# EAGLE design basic_Arduino (EAGLE 9.6.2)
CNAME: MICRO CONTROLLER+POWER+HEADERS; CREVISON: V1.0.0; DESIGNER: V KALYAN REDDY; REV: v1.0.0
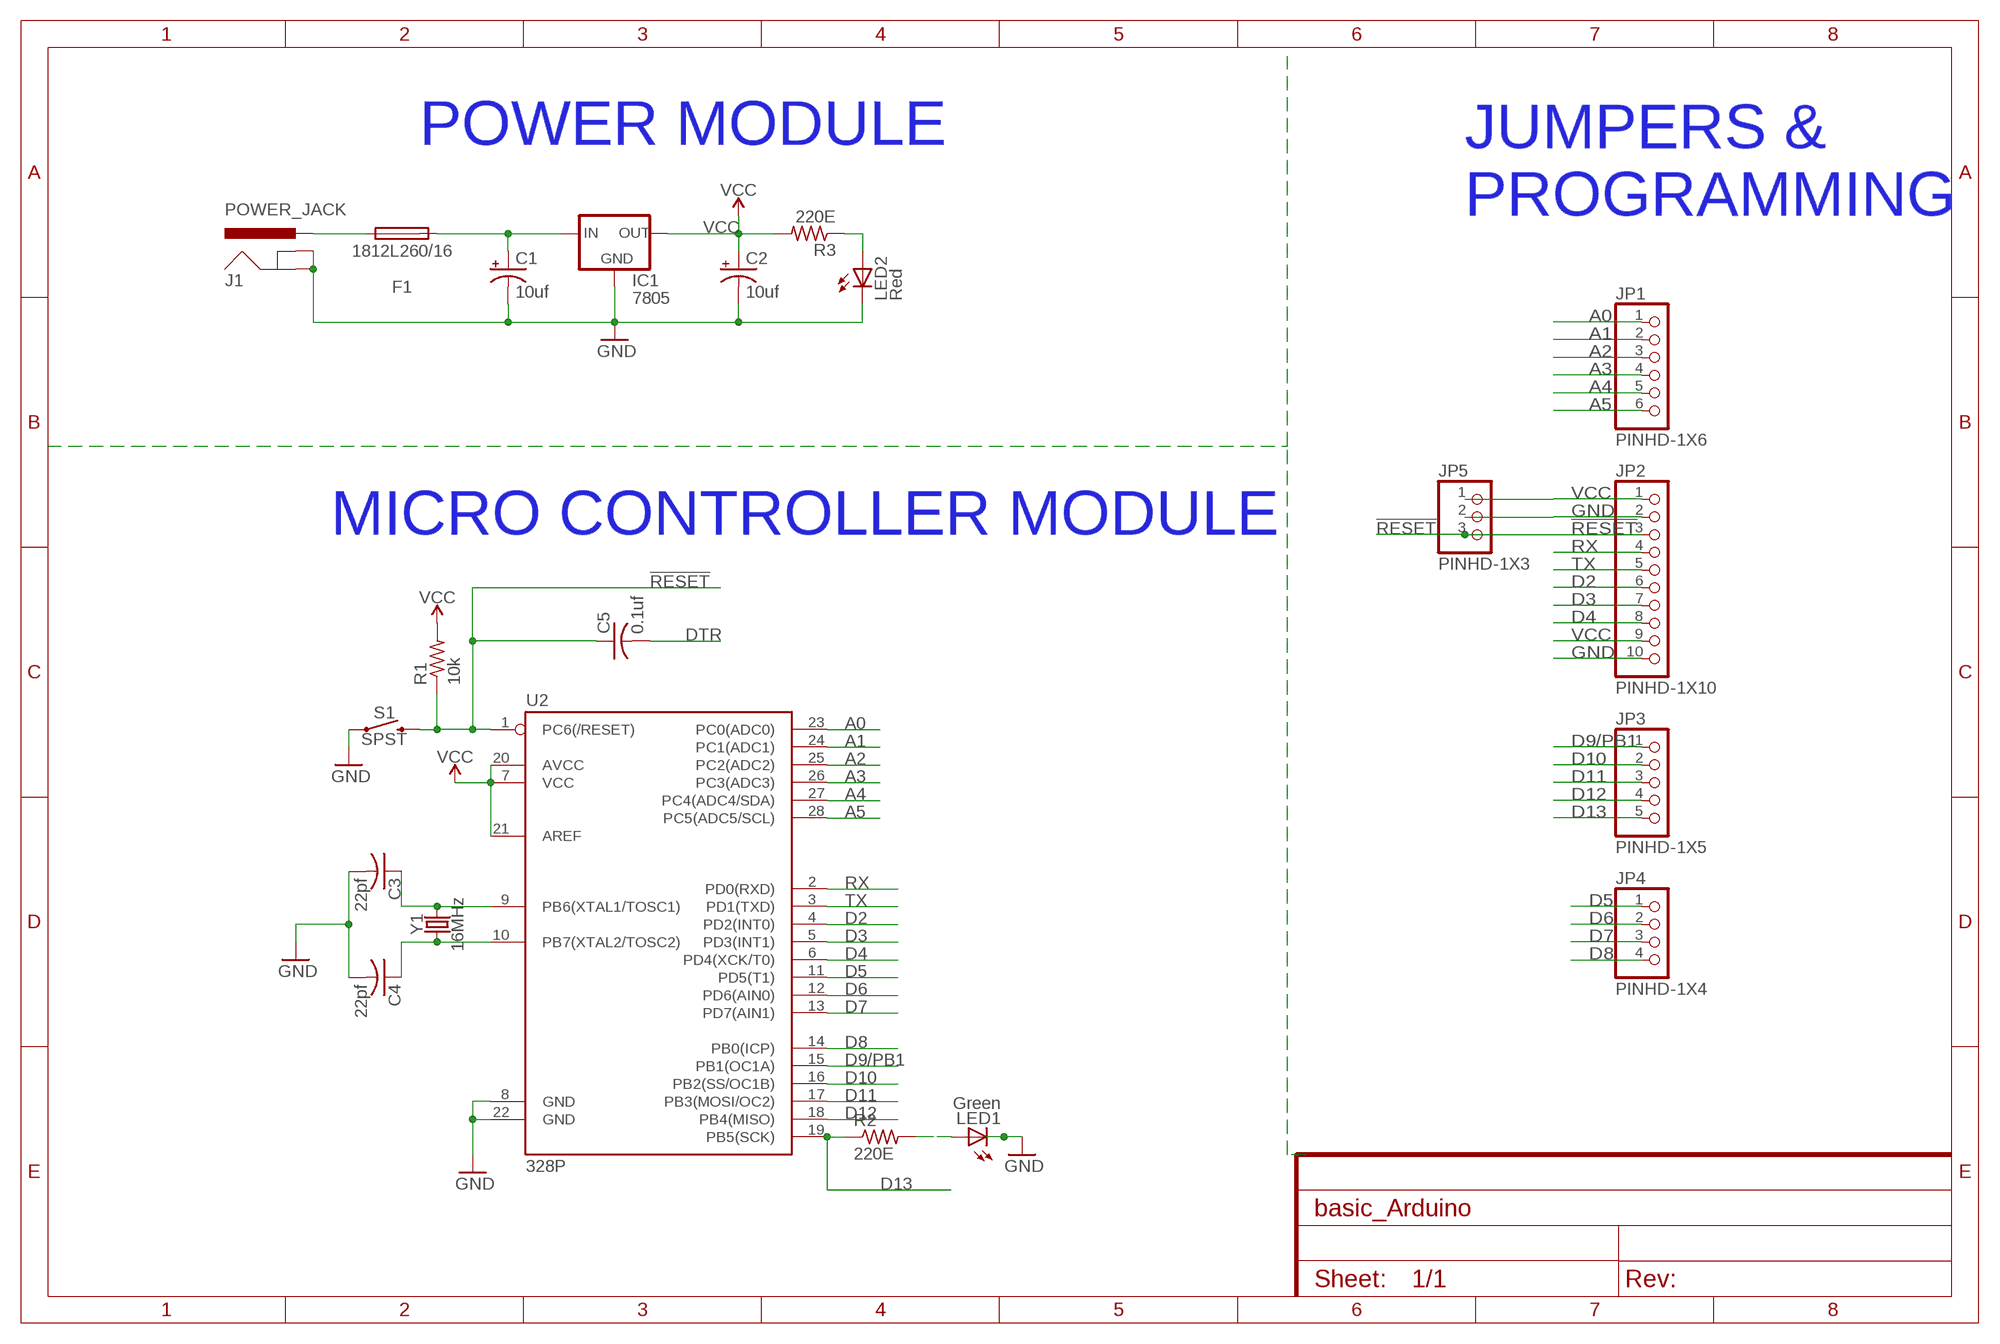
[diagram p0: schematic, sheet 1]

## Parts
C1  10uf  CPOL-USE2,5-6E  [E2,5-6E]
C2  10uf  CPOL-USE2,5-6E  [E2,5-6E]
C3  22pf  C-US025-024X044  [C025-024X044]
C4  22pf  C-US025-024X044  [C025-024X044]
C5  0.1uf  C-US025-024X044  [C025-024X044]
F1  1812L260/16  [FUSC4532X125]
IC1  7805  78XXS  [78XXS]
J1  POWER_JACK  [POWER_JACK_PTH]
JP1  PINHD-1X6  [1X06]
JP2  PINHD-1X10  [1X10]
JP3  PINHD-1X5  [1X05]
JP4  PINHD-1X4  [1X04]
JP5  PINHD-1X3  [1X03]
LED1  Green  LED3MM  [LED3MM]
LED2  Red  LED3MM  [LED3MM]
R1  10k  R-US_0204/7  [0204/7]
R2  220E  R-US_0204/7  [0204/7]
R3  220E  R-US_0204/7  [0204/7]
S1  SPST  MOMENTARY-SWITCH-SPST-PTH-6.0MM  [TACTILE_SWITCH_PTH_6.0MM]
U2  328P  ATMEGA328P_PDIP  [DIP28]
Y1  16MHz  CRYSTAL-16MHZPTH-HC49US  [HC49US]

## Nets
!RESET: C5.1 JP2.3 JP5.3 R1.1 S1.3 U2.1(PC6(/RESET))
A0: JP1.1 U2.23(PC0(ADC0))
A1: JP1.2 U2.24(PC1(ADC1))
A2: JP1.3 U2.25(PC2(ADC2))
A3: JP1.4 U2.26(PC3(ADC3))
A4: JP1.5 U2.27(PC4(ADC4/SDA))
A5: JP1.6 U2.28(PC5(ADC5/SCL))
D2: JP2.6 U2.4(PD2(INT0))
D3: JP2.7 U2.5(PD3(INT1))
D4: JP2.8 U2.6(PD4(XCK/T0))
D5: JP4.1 U2.11(PD5(T1))
D6: JP4.2 U2.12(PD6(AIN0))
D7: JP4.3 U2.13(PD7(AIN1))
D8: JP4.4 U2.14(PB0(ICP))
D9/PB1: JP3.1 U2.15(PB1(OC1A))
D10: JP3.2 U2.16(PB2(SS/OC1B))
D11: JP3.3 U2.17(PB3(MOSI/OC2))
D12: JP3.4 U2.18(PB4(MISO))
D13: JP3.5 R2.1 U2.19(PB5(SCK))
DTR: C5.2
GND: C1.- C2.- C3.2 C4.2 IC1.GND J1.GND J1.GNDBREAK JP2.2 JP2.10 JP5.2 LED1.K(C) LED2.K(C) S1.1 U2.8(GND) U2.22(GND)
N$1: C1.+ F1.2 IC1.IN
N$2: C3.1 U2.9(PB6(XTAL1/TOSC1)) Y1.2
N$3: C4.1 U2.10(PB7(XTAL2/TOSC2)) Y1.1
N$5: LED1.A R2.2
N$7: LED2.A R3.1
N$8: F1.1 J1.PWR
RX: JP2.4 U2.2(PD0(RXD))
TX: JP2.5 U2.3(PD1(TXD))
VCC: C2.+ IC1.OUT JP2.1 JP2.9 JP5.1 R1.2 R3.2 U2.7(VCC) U2.20(AVCC) U2.21(AREF)

## Notes on the sheet
- POWER MODULE
- JUMPERS & 
  PROGRAMMING
- MICRO CONTROLLER MODULE

## Library data of the parts
C1 C2 = rcl:CPOL-US: POLARIZED CAPACITOR, American symbol
C3-C5 = rcl:C-US: CAPACITOR, American symbol
F1 = Fuse:1812L: 1812L Series PTC provides surface mount overcurrent protection for applications where resettable protection is desired. Datasheet <https://www.littelfuse.com/~/media/electronics/datasheets/resettable_ptcs/littelfuse_ptc_1812l_datasheet.pdf.pdf>; CATEGORY: FUSE; DESCRIPTION: Resettable PTCs; MANUFACTURER: Littlefuse; MPN: 1812L260/12; OPERATING_TEMPERATURE: -40°C to +85°C; PART_STATUS: ACTIVE; ROHS_COMPLIANCE: RoHS Compliant; SERIES: 1812L; SUBCATEGORY: Resettable; TYPE: PTC
IC1 = v-reg:78XXS: VOLTAGE REGULATOR
J1 = SparkFun-Connectors:POWER_JACK: Power Jack Connector This is the standard 5.5mm barrel jack for power. The PTH is the most common, proven, reliable, footprint. The Slot footprint only works if the mill layer is transmitted to the PCB fab house so be warned. Here are the connectors we sell at SparkFun: DC Barrel Power Jack/Connector <https://www.sparkfun.com/products/119> (PRT-00119) DC Barrel Power Jack/Connector (SMD) <https://www.sparkfun.com/products/12748> (PRT-12748) DC Barrel Jack Adapter - Breadboard Compatible <https://www.sparkfun.com/products/10811> (PRT-10811) It is used on this SparkFun product (and many, many others): SparkFun RedBoard - Programmed with Arduino <https://www.sparkfun.com/products/12757> (DEV-12757) Also, if you need a mating power supply or connector, please check these out: Wall Adapter Power Supply - 9VDC 650mA <https://www.sparkfun.com/products/298> (TOL-00298) DC Barrel Jack Adapter - Male <https://www.sparkfun.com/products/10287> (PRT-10287); PROD_ID: CONN-08197
JP1 = Connector:PINHD-1X6: PIN HEADER; CATEGORY: CONNECTOR; SUB-CATEGORY: PIN-HEADER
JP2 = Connector:PINHD-1X10: PIN HEADER; CATEGORY: CONNECTOR; SUB-CATEGORY: PIN-HEADER
JP3 = Connector:PINHD-1X5: PIN HEADER; CATEGORY: CONNECTOR; SUB-CATEGORY: PIN-HEADER
JP4 = Connector:PINHD-1X4: PIN HEADER; CATEGORY: CONNECTOR; SUB-CATEGORY: PIN-HEADER
JP5 = Connector:PINHD-1X3: PIN HEADER; CATEGORY: CONNECTOR; SUB-CATEGORY: PIN-HEADER
LED1 LED2 = adafruit:LED: LED OSRAM: - CHIPLED LG R971, LG N971, LY N971, LG Q971, LY Q971, LO R971, LY R971 LH N974, LH R974 LS Q976, LO Q976, LY Q976 LO Q996 - Hyper CHIPLED LW Q18S LB Q993, LB Q99A, LB R99A - SideLED LS A670, LO A670, LY A670, LG A670, LP A670 LB A673, LV A673, LT A673, LW A673 LH A674 LY A675 LS A676, LA A676, LO A676, LY A676, LW A676 LS A679, LY A679, LG A679 - Hyper Micro SIDELED® LS Y876, LA Y876, LO Y876, LY Y876 LT Y87S - SmartLED LW L88C, LW L88S LB L89C, LB L89S, LG L890 LS L89K, LO L89K, LY L89K LS L896, LA L896, LO L896, LY L896 - TOPLED LS T670, LO T670, LY T670, LG T670, LP T670 LSG T670, LSP T670, LSY T670, LOP T670, LYG T670 LG T671, LOG T671, LSG T671 LB T673, LV T673, LT T673, LW T673 LH T674 LS T676, LA T676, LO T676, LY T676, LB T676, LH T676, LSB T676, LW T676 LB T67C, LV T67C, LT T67C, LS T67K, LO T67K, LY T67K, LW E67C LS E67B, LA E67B, LO E67B, LY E67B, LB E67C, LV E67C, LT E67C LW T67C LS T679, LY T679, LG T679 LS T770, LO T770, LY T770, LG T770, LP T770 LB T773, LV T773, LT T773, LW T773 LH T774 LS E675, LA E675, LY E675, LS T675 LS T776, LA T776, LO T776, LY T776, LB T776 LHGB T686 LT T68C, LB T68C - Hyper Mini TOPLED® LB M676 - Mini TOPLED Santana® LG M470 LS M47K, LO M47K, LY M47K Source: http://www.osram.convergy.de/
R1-R3 = rcl:R-US_: RESISTOR, American symbol
S1 = SparkFun-Switches:MOMENTARY-SWITCH-SPST: Momentary Switch (Pushbutton) - SPST Normally-open (NO) SPST momentary switches (buttons, pushbuttons). Variants PTH-12MM - 12mm square, through-hole Momentary Pushbutton Switch - 12mm Square <https://www.sparkfun.com/products/9190> (COM-09190) PTH-6.0MM, PTH-6.0MM-KIT - 6.0mm square, through-hole Mini Pushbutton Switch <https://www.sparkfun.com/products/97> (COM-00097) KIT package intended for soldering kit's - only one side of pads' copper is exposed. PTH-RIGHT-ANGLE-KIT - Right-angle, through-hole Right Angle Tactile Button <https://www.sparkfun.com/products/10791> - Used on SparkFun BigTime Watch Kit <https://www.sparkfun.com/products/11734> SMD-12MM - 12mm square, surface-mount Tactile Button - SMD (12mm) <https://www.sparkfun.com/products/12993> (COM-12993) Used on SparkFun PicoBoard <https://www.sparkfun.com/products/11888> SMD-4.5MM - 4.5mm Square Trackball Switch Used on SparkFun Blackberry Trackballer Breakout <https://www.sparkfun.com/products/13169> SMD-4.6MMX2.8MM - 4.60mm x 2.80mm, surface mount Used on SparkFun SAMD21 Mini Breakout <https://www.sparkfun.com/products/13664> SMD-5.2MM, SMD-5.2-REDUNDANT - 5.2mm square, surface-mount Mini Pushbutton Switch - SMD <https://www.sparkfun.com/products/8720> (COM-08720) Used on Arduino Pro Mini <https://www.sparkfun.com/products/11114> REDUNDANT package connects both switch circuits together SMD-6.0X3.5MM - 6.0 x 3.5mm, surface mount Momentary Reset Switch SMD <https://www.sparkfun.com/products/8229> (COM-08229) SMD-6.2MM-TALL - 6.2mm square, surface mount Tactile Button - SMD (6mm) <https://www.sparkfun.com/products/12992> Used on SparkFun Digital Sandbox <https://www.sparkfun.com/products/12651> SMD-RIGHT-ANGLE - Right-angle, surface mount Used on SparkFun Block for Intel® Edison - Arduino <https://www.sparkfun.com/products/13036>; PROD_ID: SWCH-08441; SF_SKU: COM-00097
U2 = SparkFun-IC-Microcontroller:ATMEGA328P_PDIP: Atmel 328P Through hole ATMEGA328P uC used in the Arduino 32kb flash, 1k EEPROM, 2k SRAM Datasheet <http://www.sparkfun.com/datasheets/Components/SMD/ATMega328.pdf> SparkFun Products Storefront component: AVR 28 Pin 20MHz 32K 6A/D - ATMega328P <https://www.sparkfun.com/products/9061> (COM-09061) SparkFun Simon Says - Through-Hole Soldering Kit <https://www.sparkfun.com/products/10547> (KIT-10547) SparkFun Learn to Solder - Simon Says <https://www.sparkfun.com/products/13708> (KIT-13708) SparkFun BigTime Watch Kit <https://www.sparkfun.com/products/11734> (KIT-11734) SparkFun ClockIt <https://www.sparkfun.com/products/10930> (KIT-10930) SparkFun Serial Enabled LCD Kit <https://www.sparkfun.com/products/10097> (LCD-10097) SparkFun Simon Tilts - Through Hole Soldering Kit <https://www.sparkfun.com/products/12634> (KIT-12634) SparkFun Frequency Counter Kit <https://www.sparkfun.com/products/10140> (KIT-10140) FabFM Radio Kit <https://www.sparkfun.com/products/11043> (KIT-11043) SparkFun Binary Blaster Kit <https://www.sparkfun.com/products/12037> (KIT-12037) SparkFun Metro-Gnome <https://www.sparkfun.com/products/9236> (KIT-09236) ATmega328 with Arduino Optiboot (Uno) <https://www.sparkfun.com/products/10524> (DEV-10524); PROD_ID: IC-09136
Y1 = SparkFun-Clocks:CRYSTAL-16MHZ: 16MHz Crystal Digikey Example <http://www.digikey.com/product-search/en?keywords=535-9122-1-ND> Frequency: 16MHz Frequency Stability: ±50ppm Frequency Tolerance: ±20ppm Load Capacitance: 18pF SparkFun Products: Pro Micro -5V/16MHz <https://www.sparkfun.com/products/12640> SparkFun Serial Enabled LCD Kit <https://www.sparkfun.com/products/10097>; PROD_ID: XTAL-08181; SF_ID: COM-00536

## Board
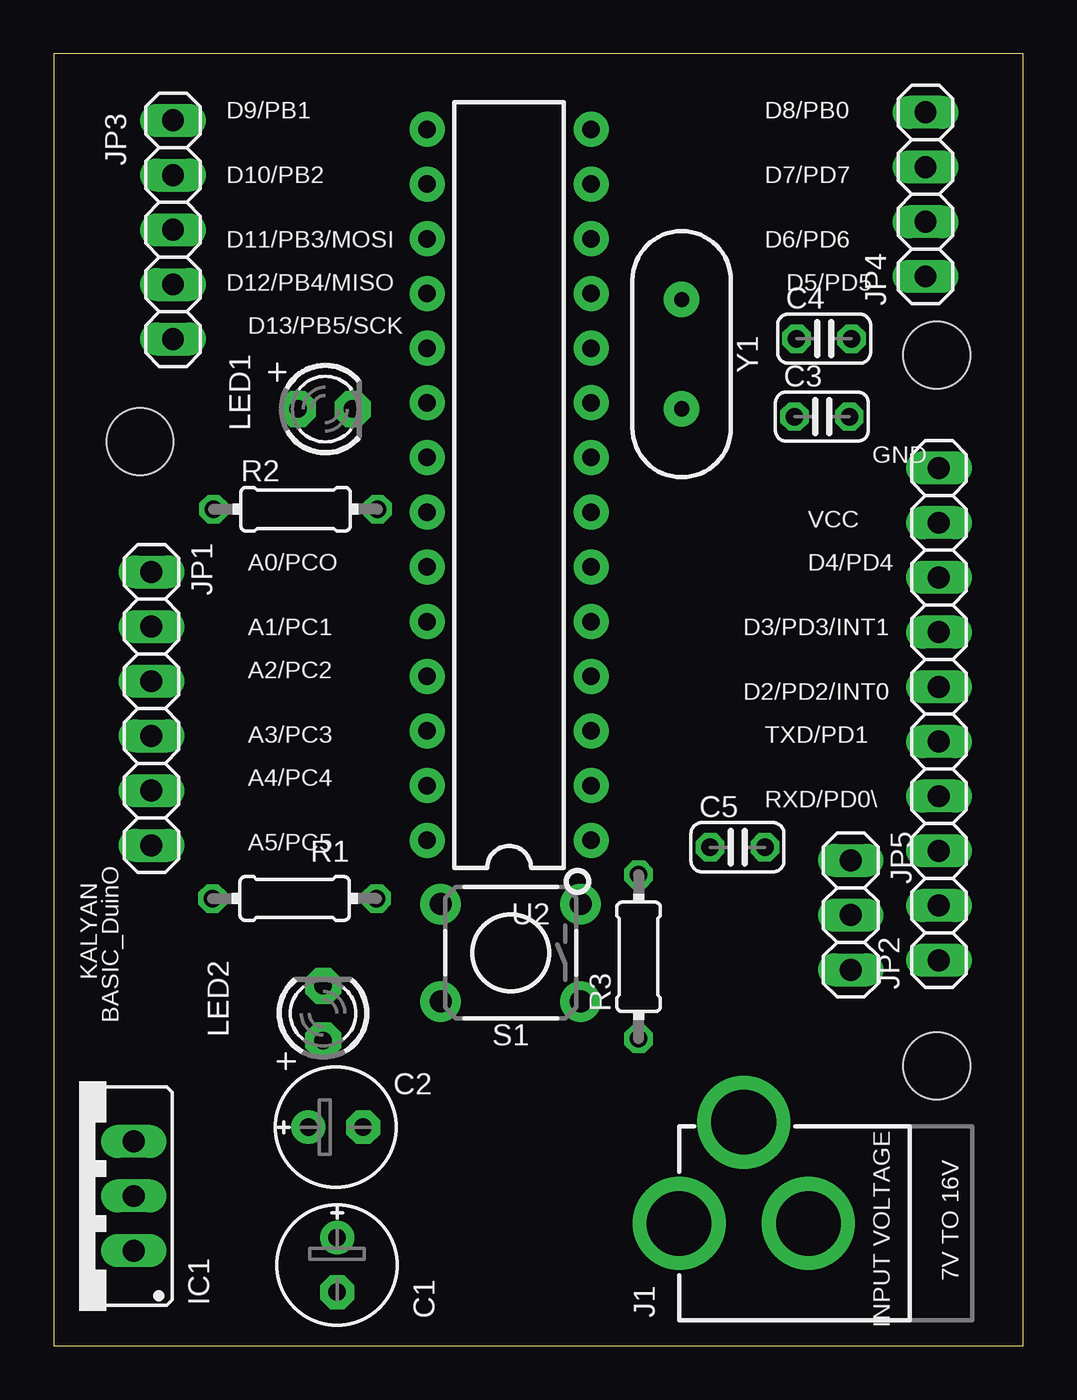
[diagram p1: board, top side]
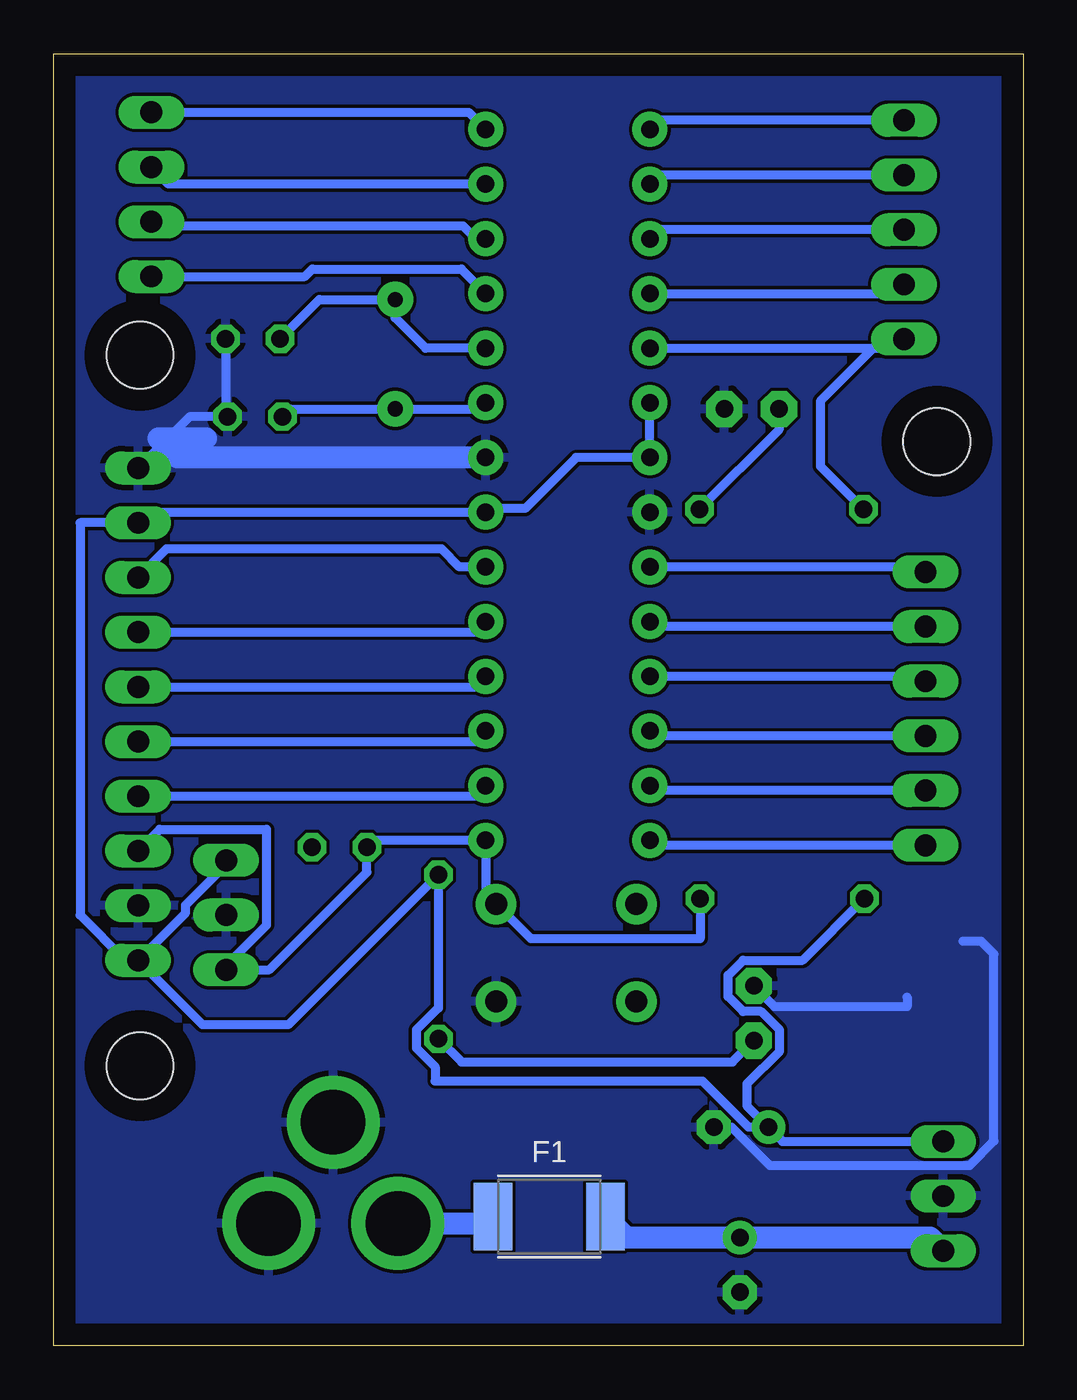
[diagram p2: board, bottom side, seen from below]

Size 45 x 60 mm. Coordinates in mm from the lower left corner, seen from the top.
Outline: 0,0 45,0 45,60 0,60 0,0
Copper layers (1*16): Top 0.035mm / dielectric 1.5mm / Bottom 0.035mm
Design rules "default": minimum track width 6mil, minimum drill 0.35mm, track to track 6mil, track to pad 6mil, pad to pad 6mil, via to via 6mil, smd to smd 6mil, copper to edge 40mil, drill to drill 6mil, minimum pad ring 10mil, minimum via ring 8mil, stop-mask expansion 4mil, vias tented up to drill 0mil, thermal gap 10mil
Holes 3.1 mm at 4,42 41,13 41,46

### Footprints (pad centres in the part's own frame; a part is rotated, then mirrored left to right if it is on the bottom)
E2,5-6E = drill 0.813 pad 1.575: + -1.27,0 | drill 0.813 pad 1.575 octagon: - 1.27,0
C025-024X044 = drill 0.813 octagon: 1 -1.27,0; 2 1.27,0
FUSC4532X125 = smd 1.78 x 3.15: 1 -2.615,0; 2 2.615,0
78XXS = drill 1.016 long: GND 0,-2.54; IN -2.54,-2.54; OUT 2.54,-2.54
POWER_JACK_PTH = drill 2.997 pad 4.318: GND 0,7.7; GNDBREAK 4.7,10.7; PWR 0,13.7
1X06 = drill 1.016 long: 1 -6.35,0; 2 -3.81,0; 3 -1.27,0; 4 1.27,0; 5 3.81,0; 6 6.35,0
1X10 = drill 1.016 long: 1 -11.43,0; 2 -8.89,0; 3 -6.35,0; 4 -3.81,0; 5 -1.27,0; 6 1.27,0; 7 3.81,0; 8 6.35,0; 9 8.89,0; 10 11.43,0
1X05 = drill 1.016 long: 1 -5.08,0; 2 -2.54,0; 3 0,0; 4 2.54,0; 5 5.08,0
1X04 = drill 1.016 long: 1 -3.81,0; 2 -1.27,0; 3 1.27,0; 4 3.81,0
1X03 = drill 1.016 long: 1 -2.54,0; 2 0,0; 3 2.54,0
LED3MM = drill 0.813 pad 1.676 octagon: A -1.27,0; K 1.27,0
0204/7 = drill 0.813 octagon: 1 -3.81,0; 2 3.81,0
TACTILE_SWITCH_PTH_6.0MM = drill 1.016 pad 1.88: 1 -3.251,2.261; 2 3.251,2.261; 3 -3.251,-2.261; 4 3.251,-2.261
DIP28 = drill 0.813 pad 1.626: 1 -16.51,-3.81; 2 -13.97,-3.81; 3 -11.43,-3.81; 4 -8.89,-3.81; 5 -6.35,-3.81; 6 -3.81,-3.81; 7 -1.27,-3.81; 8 1.27,-3.81; 9 3.81,-3.81; 10 6.35,-3.81; 11 8.89,-3.81; 12 11.43,-3.81; 13 13.97,-3.81; 14 16.51,-3.81; 15 16.51,3.81; 16 13.97,3.81; 17 11.43,3.81; 18 8.89,3.81; 19 6.35,3.81; 20 3.81,3.81; 21 1.27,3.81; 22 -1.27,3.81; 23 -3.81,3.81; 24 -6.35,3.81; 25 -8.89,3.81; 26 -11.43,3.81; 27 -13.97,3.81; 28 -16.51,3.81
HC49US = drill 0.7 pad 1.651: 1 -2.54,0; 2 2.54,0

### Placement (x,y rotation side)
C1  13.15,3.75 270 top
C2  13.09,10.15 0 top
C3  35.66,43.15 0 top
C4  35.76,46.77 0 top
C5  31.74,23.15 0 top
F1  22,6 0 bottom
IC1  1.17,6.95 90 top
J1  42.73,5.68 90 top
JP1  4.53,29.59 270 top
JP2  41.09,29.33 90 top
JP3  5.53,51.83 270 top
JP4  40.47,53.47 90 top
JP5  37,20 270 top
LED1  12.6,43.5 0 top
LED2  12.5,15.44 90 top
R1  11.18,20.77 180 top
R2  11.22,38.85 0 top
R3  27.15,18.06 90 top
S1  21.21,18.25 180 top
U2  21.14,39.98 90 top
Y1  29.15,46.05 270 top

### Tracks (layer width: path | path; a pad name or v marks a point on that pad's centre or on a via)
!RESET
  Bottom 0.406: R1.1 14.99,18.9 22.85,18.9 S1.3 24.95,21 U2.1 30.15,23.47 C5.1 30.47,21.99 35,17.46 JP5.3 37,17.66 35.12,19.54 35.12,23.98 40.09,23.98 JP2.3
A0
  Bottom 0.406: JP1.1 4.76,36.17 U2.23
A1
  Bottom 0.406: JP1.2 17.1,33.4 U2.24
A2
  Bottom 0.406: JP1.3 4.76,31.09 U2.25
A3
  Bottom 0.406: JP1.4 17.1,28.32 U2.26
A4
  Bottom 0.406: JP1.5 17.1,25.78 U2.27
A5
  Bottom 0.406: JP1.6 17.1,23.24 U2.28
D2
  Bottom 0.406: JP2.6 25.44,30.6 U2.4
D3
  Bottom 0.406: JP2.7 25.44,33.14 U2.5
D4
  Bottom 0.406: U2.6 26.17,36.17 27,37 39.77,37 JP2.8
D5
  Bottom 0.406: U2.11 26.08,50 33,50 33.34,49.66 JP4.1
D6
  Bottom 0.406: U2.12 25.41,51.41 26,52 40.27,52 JP4.2
D7
  Bottom 0.406: U2.13 39.68,53.95 JP4.3
D8
  Bottom 0.406: JP4.4 25.74,57.28 U2.14
D9/PB1
  Bottom 0.406: JP3.1 16.91,56.91 U2.15
D10
  Bottom 0.406: JP3.2 16.91,54.37 U2.16
D11
  Bottom 0.406: JP3.3 16.91,51.83 U2.17
D12
  Bottom 0.406: U2.18 5.95,48.87 JP3.4
D13
  Bottom 0.406: U2.19 5.95,46.33 JP3.5 6.53,46.75 9.41,43.87 9.41,40.85 R2.1
GND
  Bottom 0.406: 2.79,18.79 1.95,18.79 1.35,18.19 1.35,9.5 2.48,8.37 11.76,8.37 13.53,10.15 C2.- | 5.39,16.19 5.39,15.75 11.54,15.75 LED2.K | 37.03,43.25 C3.2 | C3.2 37.15,43.15 37.03,43.27 C4.2 | C3.2 38.7,43.15 JP2.10
  Bottom 1.016: U2.8 39.25,41.25 40.15,42.15 37.93,42.15
  pour Bottom: 0,0 45,0 45,60 0,60
N$1
  Bottom 1.016: IC1.IN 4.32,5.02 C1.+ 18.41,5.02 F1.2
N$2
  Bottom 0.406: C3.1 34.03,43.51 Y1.2 25.23,43.51 U2.9
N$3
  Bottom 0.406: U2.10 27.74,46.33 29.15,47.74 Y1.1 32.67,48.59 C4.1
N$5
  Bottom 0.406: LED1.A 11.33,42.55 R2.2
N$7
  Bottom 0.406: LED2.A 13.5,13.17 26.07,13.17 R3.1
N$8
  Bottom 1.016: J1.PWR 24.93,5.68 F1.1
RX
  Bottom 0.406: JP2.4 25.44,25.52 U2.2
TX
  Bottom 0.406: JP2.5 25.44,28.06 U2.3
VCC
  Bottom 0.406: C2.+ 12.74,10.15 14.89,12.29 27.29,12.29 27.29,12.96 28.17,13.83 28.17,14.67 27.15,15.69 R3.2 34.12,14.9 38.09,14.9 JP2.1 | U2.20 U2.21 20.75,41.25 23.12,38.88 25.12,38.88 U2.7 40.6,38.71 JP2.9 43.78,38.22 43.78,20 41.68,17.9 JP2.1 | C2.+ 11.16,9.49 IC1.OUT | C2.+ 12.82,11.15 12.82,12.16 11.31,13.68 11.31,14.66 12.16,15.52 12.99,15.52 13.69,16.22 13.69,17.2 12.99,17.9 10.24,17.9 R1.2 | JP2.1 38.88,20.11 38.88,20.46 37,22.34 JP5.1

### Text on the board
_tsilk: D9/PB1 | D8/PB0 | D10/PB2 | D7/PD7 | D11/PB3/MOSI | D6/PD6 | D12/PB4/MISO | D5/PD5 | D13/PB5/SCK | GND | VCC | A0/PCO | D4/PD4 | A1/PC1 | D3/PD3/INT1 | A2/PC2 | D2/PD2/INT0 | A3/PC3 | TXD/PD1 | A4/PC4 | RXD/PD0\ | A5/PC5 | KALYAN | BASIC_DuinO | INPUT VOLTAGE | 7V TO 16V